# EAGLE design func_gen (EAGLE 6.3)
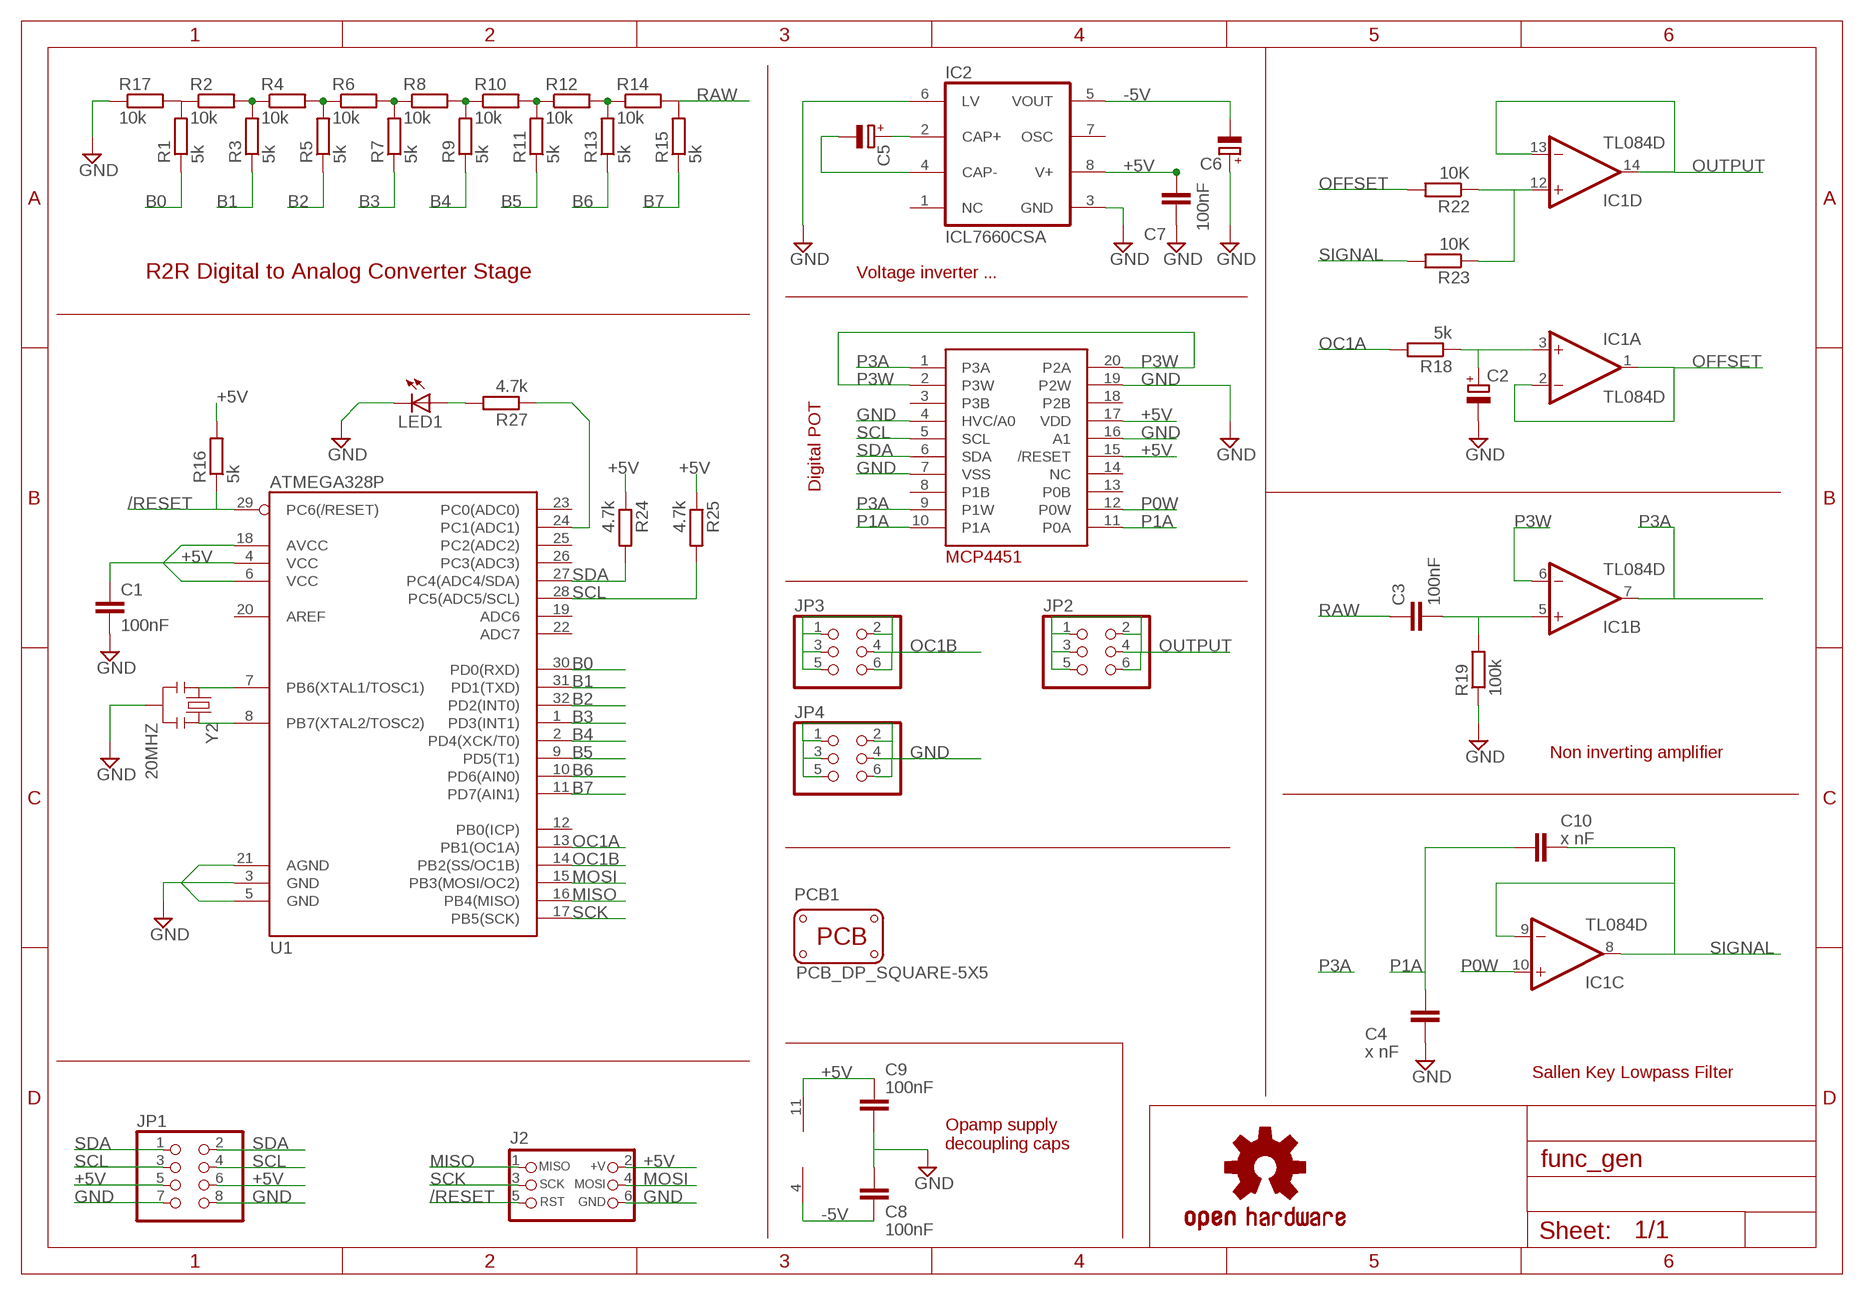
[diagram p0: schematic, sheet 1]

## Parts
C1  100nF  C-EUC0603  [C0603]
C2  CPOL-EUE5-5  [E5-5]
C3  100nF  C-EUC0603  [C0603]
C4  x nF  C-EUC0603  [C0603]
C5  CPOL-EUE5-5  [E5-5]
C6  CPOL-EUE5-5  [E5-5]
C7  100nF  C-EUC0603  [C0603]
C8  100nF  C-EUC0603  [C0603]
C9  100nF  C-EUC0603  [C0603]
C10  x nF  C-EUC0603  [C0603]
IC1  TL084D  [SO14]
IC2  ICL7660CSA  [SO08]
J2  CON_HEADER_PRG_AVR_ICSP  [HEADER_PRG_2X03]
JP1  PINHD-2X4  [2X04]
JP2  PINHD-2X3  [2X03]
JP3  PINHD-2X3  [2X03]
JP4  PINHD-2X3  [2X03]
LED1  LED-0805  [LED-805]
LOGO1  OSHW-LOGOM  [OSHW-LOGO-M]
PCB1  PCB_DP_SQUARE-5X5  [DP5050_V1]
R1  5k  R-EU_R0603  [R0603]
R2  10k  R-EU_R0603  [R0603]
R3  5k  R-EU_R0603  [R0603]
R4  10k  R-EU_R0603  [R0603]
R5  5k  R-EU_R0603  [R0603]
R6  10k  R-EU_R0603  [R0603]
R7  5k  R-EU_R0603  [R0603]
R8  10k  R-EU_R0603  [R0603]
R9  5k  R-EU_R0603  [R0603]
R10  10k  R-EU_R0603  [R0603]
R11  5k  R-EU_R0603  [R0603]
R12  10k  R-EU_R0603  [R0603]
R13  5k  R-EU_R0603  [R0603]
R14  10k  R-EU_R0603  [R0603]
R15  5k  R-EU_R0603  [R0603]
R16  5k  R-EU_R0603  [R0603]
R17  10k  R-EU_R0603  [R0603]
R18  5k  R-EU_R0603  [R0603]
R19  100k  R-EU_R0603  [R0603]
R22  10K  R-EU_R0603  [R0603]
R23  10K  R-EU_R0603  [R0603]
R24  4.7k  R-EU_R0603  [R0603]
R25  4.7k  R-EU_R0603  [R0603]
R27  4.7k  R-EU_R0603  [R0603]
U1  ATMEGA328P  ATMEGA328_SMT  [TQFP32-08]
U$1  IHSAN_MCP4451DOGRU  [TSSOP20]
Y2  20MHZ  RESONATORPTH  [RESONATOR-PTH]

## Nets
+5V: C1.1 C7.2 C9.2 IC1.11(P:V-) IC2.8(V+) J2.2(+V) JP1.5 JP1.6 R16.2 R24.1 R25.1 U1.4(VCC) U1.6(VCC) U1.18(AVCC) U$1.15(/RESET) U$1.17(VDD)
-5V: C6.- C8.1 IC1.4(P:V+) IC2.5(VOUT)
/RESET: J2.5(RST) R16.1 U1.29(PC6(/RESET))
B0: R1.1 U1.30(PD0(RXD))
B1: R3.1 U1.31(PD1(TXD))
B2: R5.1 U1.32(PD2(INT0))
B3: R7.1 U1.1(PD3(INT1))
B4: R9.1 U1.2(PD4(XCK/T0))
B5: R11.1 U1.9(PD5(T1))
B6: R13.1 U1.10(PD6(AIN0))
B7: R15.1 U1.11(PD7(AIN1))
GND: C1.2 C2.- C4.1 C6.+ C7.1 C8.2 C9.1 IC2.3(GND) IC2.6(LV) J2.6(GND) JP1.7 JP1.8 JP4.1 JP4.2 JP4.3 JP4.4 JP4.5 JP4.6 LED1.C R17.1 R19.1 U1.3(GND) U1.5(GND) U1.21(AGND) U$1.4(HVC/A0) U$1.7(VSS) U$1.16(A1) U$1.19(P2W) Y2.2
MISO: J2.1(MISO) U1.16(PB4(MISO))
MOSI: J2.4(MOSI) U1.15(PB3(MOSI/OC2))
N$1: R1.2 R2.1 R17.2
N$2: R2.2 R3.2 R4.1
N$3: R4.2 R5.2 R6.1
N$4: R6.2 R7.2 R8.1
N$5: R8.2 R9.2 R10.1
N$6: R10.2 R11.2 R12.1
N$7: R12.2 R13.2 R14.1
N$8: U1.8(PB7(XTAL2/TOSC2)) Y2.3
N$9: U1.7(PB6(XTAL1/TOSC1)) Y2.1
N$10: C2.+ IC1.3(A:+IN) R18.1
N$11: C3.2 IC1.5(B:+IN) R19.2
N$12: C5.+ IC2.2(CAP+)
N$13: C5.- IC2.4(CAP-)
N$16: IC1.12(D:+IN) R22.1 R23.1
N$17: R27.1 U1.24(PC1(ADC1))
N$18: LED1.A R27.2
OC1A: R18.2 U1.13(PB1(OC1A))
OC1B: JP3.1 JP3.2 JP3.3 JP3.4 JP3.5 JP3.6 U1.14(PB2(SS/OC1B))
OFFSET: IC1.1(A:OUT) IC1.2(A:-IN) R22.2
OUTPUT: IC1.13(D:-IN) IC1.14(D:OUT) JP2.1 JP2.2 JP2.3 JP2.4 JP2.5 JP2.6
P0W: IC1.10(C:+IN) U$1.12(P0W)
P1A: C4.2 C10.1 U$1.10(P1A) U$1.11(P0A)
P3A: IC1.7(B:OUT) U$1.1(P3A) U$1.9(P1W)
P3W: IC1.6(B:-IN) U$1.2(P3W) U$1.20(P2A)
RAW: C3.1 R14.2 R15.2
SCK: J2.3(SCK) U1.17(PB5(SCK))
SCL: JP1.3 JP1.4 R25.2 U1.28(PC5(ADC5/SCL)) U$1.5(SCL)
SDA: JP1.1 JP1.2 R24.2 U1.27(PC4(ADC4/SDA)) U$1.6(SDA)
SIGNAL: C10.2 IC1.8(C:OUT) IC1.9(C:-IN) R23.2
Unconnected: IC2.1(NC) IC2.7(OSC) U1.12(PB0(ICP)) U1.19(ADC6) U1.20(AREF) U1.22(ADC7) U1.23(PC0(ADC0)) U1.25(PC2(ADC2)) U1.26(PC3(ADC3)) U$1.3(P3B) U$1.8(P1B) U$1.13(P0B) U$1.14(NC) U$1.18(P2B)

## Notes on the sheet
- R2R Digital to Analog Converter Stage | Voltage inverter ...
- Digital POT
- Non inverting amplifier
- Sallen Key Lowpass Filter
- Opamp supply
  decoupling caps

## Library data of the parts
C1 C3 C4 C7-C10 = rcl:C-EU: CAPACITOR, European symbol
C2 C5 C6 = rcl:CPOL-EU: POLARIZED CAPACITOR, European symbol
IC1 = linear:TL084: OP AMP
IC2 = maxim:ICL7660CSA: VOLTAGE CONVERTER; MF: MAXIM; MPN: ICL7660CSA; OC_FARNELL: 9724710; OC_NEWARK: 34C3732
J2 = dp_devices:CON_HEADER_PRG_AVR_ICSP: 2x3 AVR ICSP programming header
JP1 = pinhead:PINHD-2X4: PIN HEADER
JP2-JP4 = pinhead:PINHD-2X3: PIN HEADER
LED1 = dp_devices:LED: Light Emitting Diode
LOGO1 = SparkFun-Aesthetics:OSHW-LOGO: Open Source Hardware Logo This logo indicates the piece of hardware it is found on incorporates a OSHW license and/or adheres to the definition of open source hardware found here: http://freedomdefined.org/OSHW
PCB1 = dp_devices:PCB_DP_SQUARE: Dangerous Prototypes Standard Square PCB sizes
R1-R19 R22-R25 R27 = rcl:R-EU_: RESISTOR, European symbol
U1 = SparkFun-DigitalIC:ATMEGA328_SMT: 32-Pin Atmega328 part Commonly used on Arduino compatible boards Available in QFP and QFN packages TQFP is IC-09069 QFN is non-stock; PROD_ID: IC-09069
U$1 = SparkFun-DigitalIC:IHSAN_MCP4451
Y2 = SparkFun-FreqCtrl:RESONATOR: Resonator Small SMD resonator. Used, eg, on the Arduino Pro/ Pro Mini boards. 8MHz- XTAL-08895 16MHz- XTAL-08900

## Board
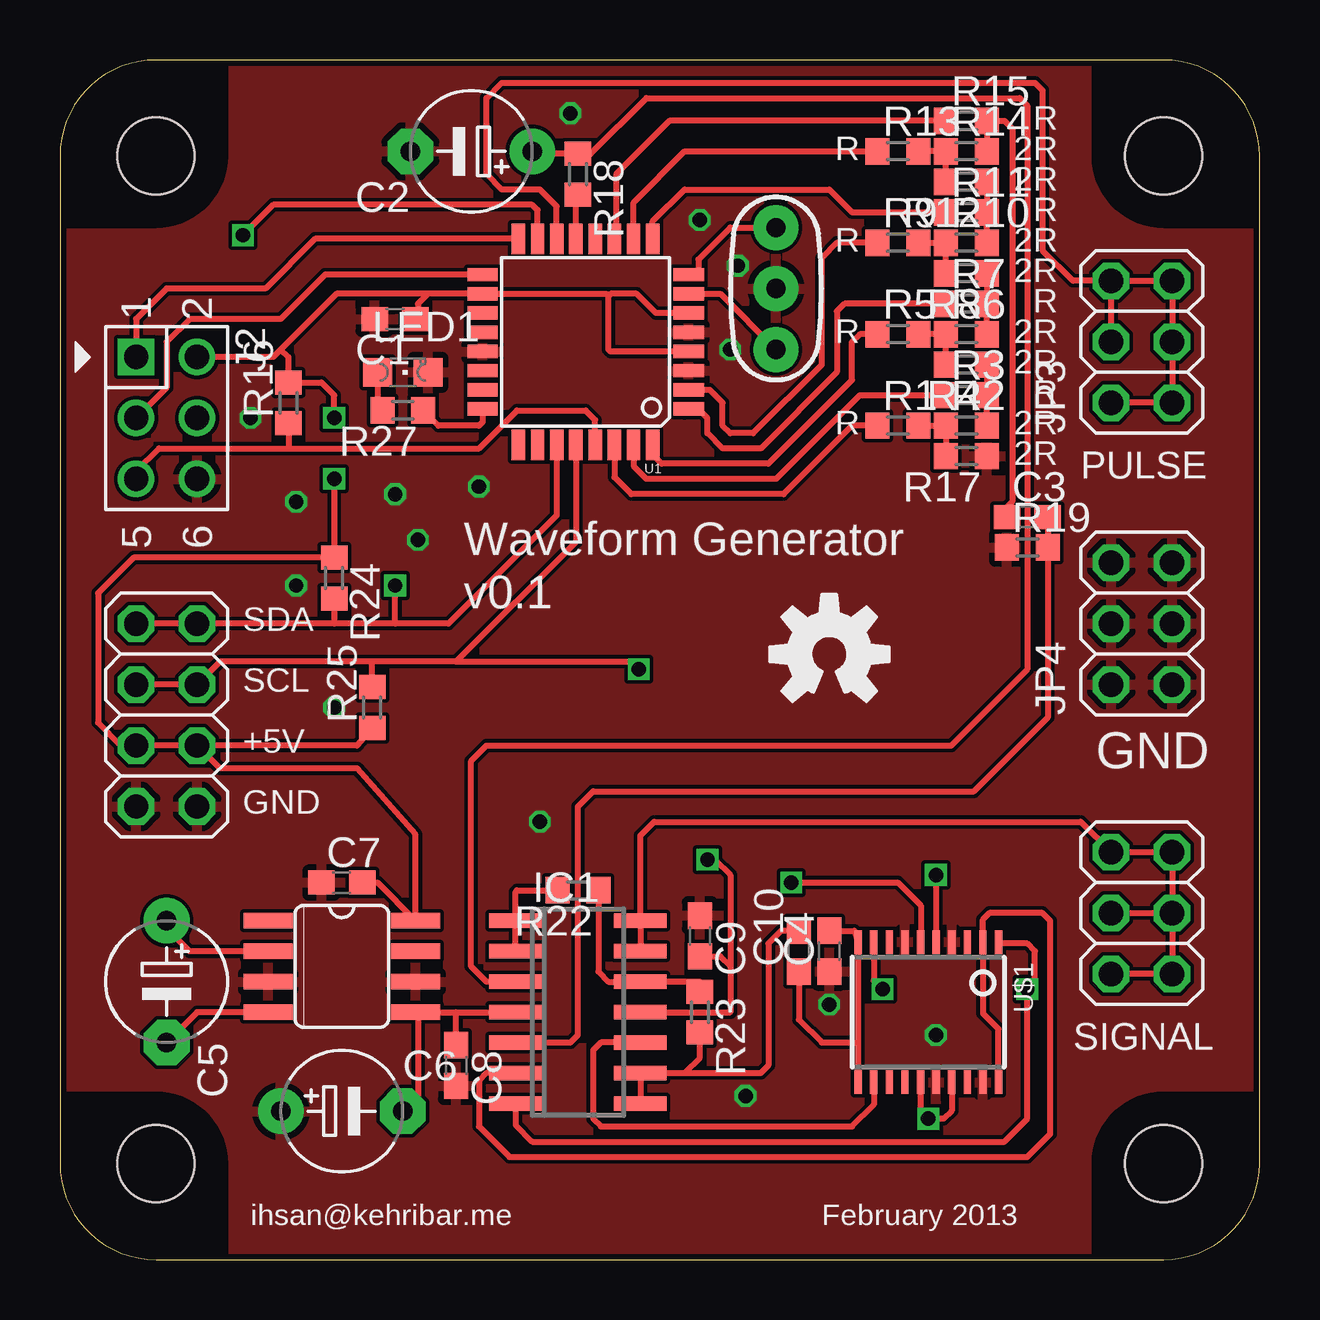
[diagram p1: board, top side]
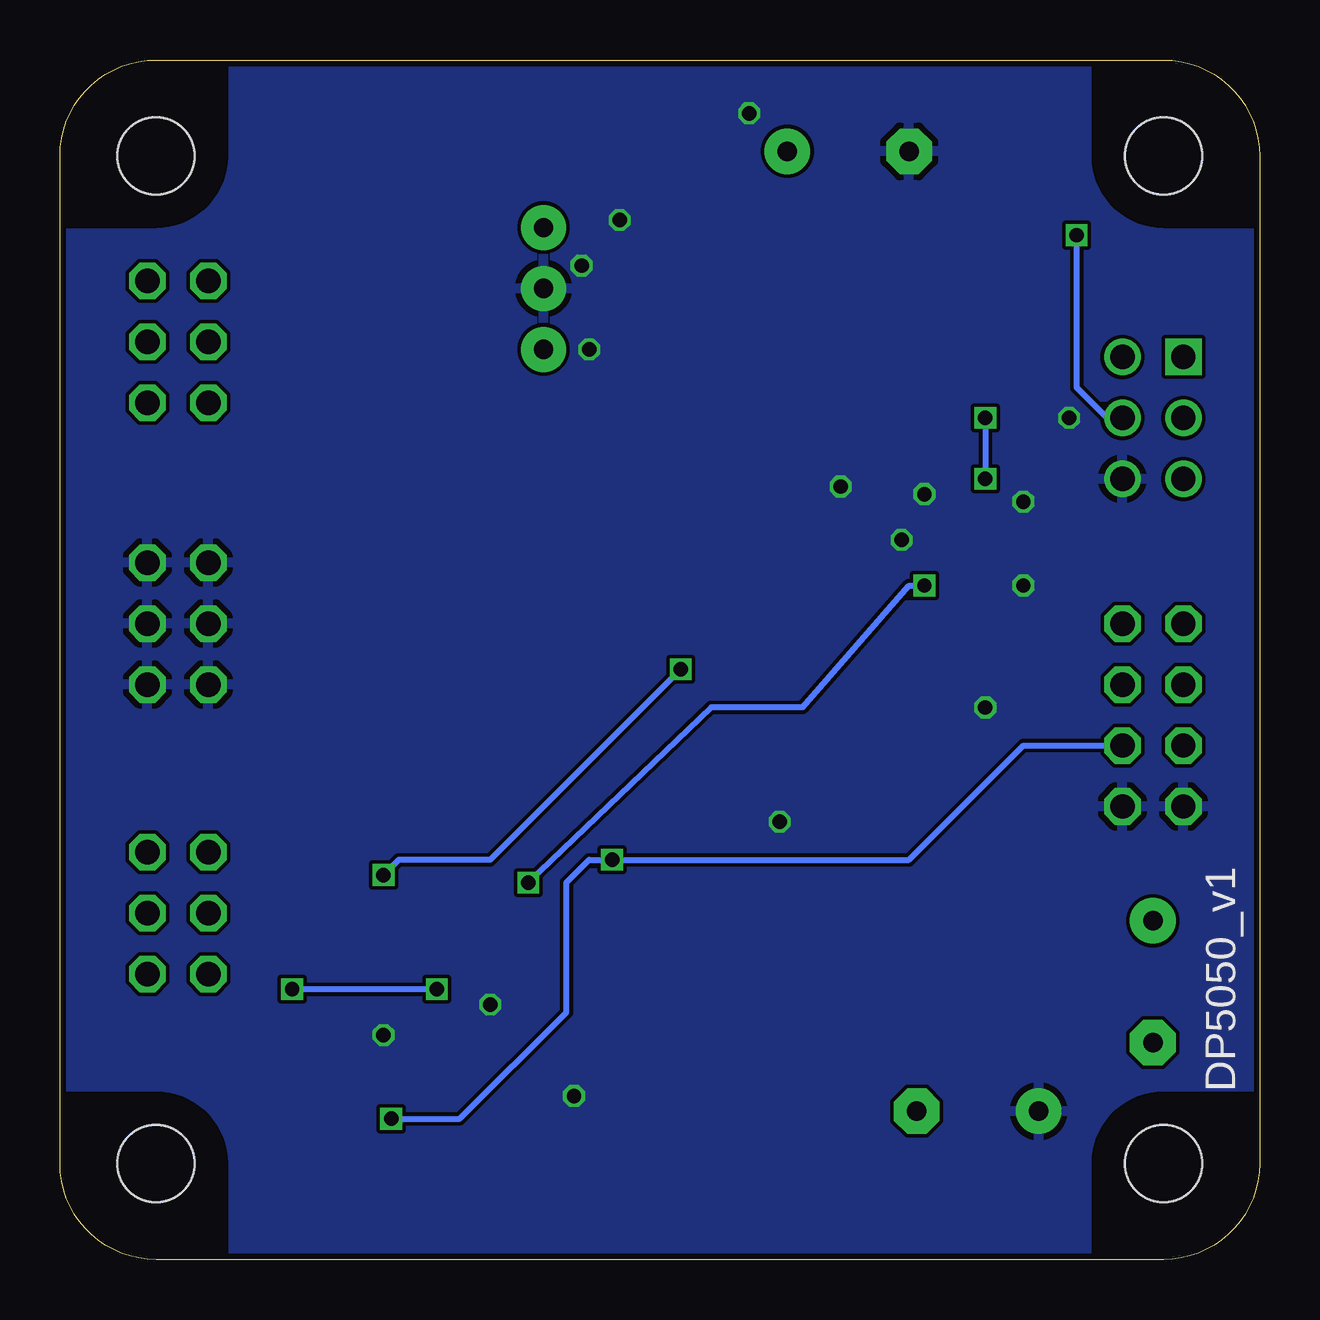
[diagram p2: board, bottom side, seen from below]

Size 50 x 50 mm. Coordinates in mm from the lower left corner, seen from the top.
Copper layers (1*16): Top 0.035mm / dielectric 1.5mm / Bottom 0.035mm
Design rules "Fusion_eagle_rule_v1.1": minimum track width 6mil, minimum drill 12mil, track to track 6mil, track to pad 6mil, pad to pad 6mil, via to via 6mil, smd to smd 0mil, copper to edge 10mil, drill to drill 10mil, minimum pad ring 10mil, minimum via ring 6mil, stop-mask expansion 2mil, vias tented up to drill 100mil, thermal gap 10mil

### Footprints (pad centres in the part's own frame; a part is rotated, then mirrored left to right if it is on the bottom)
C0603 = smd 1.1 x 1: 1 -0.85,0; 2 0.85,0
E5-5 = drill 0.813 pad 1.905: + -2.54,0 | drill 0.813 pad 1.905 octagon: - 2.54,0
SO14 = smd 0.6 x 2.2: 1 -3.81,-2.6; 2 -2.54,-2.6; 3 -1.27,-2.6; 4 0,-2.6; 5 1.27,-2.6; 6 2.54,-2.6; 7 3.81,-2.6; 8 3.81,2.6; 9 2.54,2.6; 10 1.27,2.6; 11 0,2.6; 12 -1.27,2.6; 13 -2.54,2.6; 14 -3.81,2.6
SO08 = smd 0.66 x 2.032: 1 -1.905,-3.073; 2 -0.635,-3.073; 3 0.635,-3.073; 4 1.905,-3.073; 5 1.905,3.073; 6 0.635,3.073; 7 -0.635,3.073; 8 -1.905,3.073
HEADER_PRG_2X03 = drill 1.016 square: 1 -2.54,-1.27 | drill 1.016: 2 -2.54,1.27; 3 0,-1.27; 4 0,1.27; 5 2.54,-1.27; 6 2.54,1.27
2X04 = drill 1.016 octagon: 1 -3.81,-1.27; 2 -3.81,1.27; 3 -1.27,-1.27; 4 -1.27,1.27; 5 1.27,-1.27; 6 1.27,1.27; 7 3.81,-1.27; 8 3.81,1.27
2X03 = drill 1.016 octagon: 1 -2.54,-1.27; 2 -2.54,1.27; 3 0,-1.27; 4 0,1.27; 5 2.54,-1.27; 6 2.54,1.27
LED-805 = smd 1.2 x 1.2: A 0,-1.05; C 0,1.05
DP5050_V1 = hole 3.2: 4,4; 46,4; 46,46; 4,46
R0603 = smd 1 x 1.1: 1 -0.85,0; 2 0.85,0
TQFP32-08 = smd 1.27 x 0.559: 1 -4.293,2.8; 2 -4.293,2; 3 -4.293,1.2; 4 -4.293,0.4; 5 -4.293,-0.4; 6 -4.293,-1.2; 7 -4.293,-2; 8 -4.293,-2.8; 17 4.293,-2.8; 18 4.293,-2; 19 4.293,-1.2; 20 4.293,-0.4; 21 4.293,0.4; 22 4.293,1.2; 23 4.293,2; 24 4.293,2.8 | smd 0.559 x 1.27: 9 -2.8,-4.293; 10 -2,-4.293; 11 -1.2,-4.293; 12 -0.4,-4.293; 13 0.4,-4.293; 14 1.2,-4.293; 15 2,-4.293; 16 2.8,-4.293; 25 2.8,4.293; 26 2,4.293; 27 1.2,4.293; 28 0.4,4.293; 29 -0.4,4.293; 30 -1.2,4.293; 31 -2,4.293; 32 -2.8,4.293
TSSOP20 = smd 0.305 x 0.991: 1 -2.925,-2.918; 2 -2.275,-2.918; 3 -1.625,-2.918; 4 -0.975,-2.918; 5 -0.325,-2.918; 6 0.325,-2.918; 7 0.975,-2.918; 8 1.625,-2.918; 9 2.275,-2.918; 10 2.925,-2.918; 11 2.925,2.918; 12 2.275,2.918; 13 1.625,2.918; 14 0.975,2.918; 15 0.325,2.918; 16 -0.325,2.918; 17 -0.975,2.918; 18 -1.625,2.918; 19 -2.275,2.918; 20 -2.925,2.918
RESONATOR-PTH = drill 0.8 pad 1.88: 1 -2.54,0; 2 0,0; 3 2.54,0

### Placement (x,y rotation side)
C1  13.97,39.2 180 top
C2  17.14,46.19 180 top
C3  40.32,30.95 0 top
C4  32.07,12.85 90 top
C5  4.45,11.58 270 top
C6  11.75,6.19 0 top
C7  11.75,15.71 0 top
C8  16.51,8.09 270 top
C9  26.67,13.49 270 top
C10  30.8,12.85 90 top
IC1  21.59,10.31 270 top
IC2  11.75,12.22 270 top
J2  4.45,35.08 270 top
JP1  4.45,22.7 270 top
JP2  45.09,14.44 90 top
JP3  45.09,38.25 90 top
JP4  45.09,26.51 90 top
LED1  14.29,36.98 270 top
LOGO1  32.07,25.23 0 top
PCB1  0,50 270 top
R1  34.92,34.76 0 top
R2  37.78,34.76 0 top
R3  37.78,36.03 0 top
R4  37.78,37.3 180 top
R5  34.92,38.57 0 top
R6  37.78,38.57 0 top
R7  37.78,39.84 0 top
R8  37.78,41.11 180 top
R9  34.92,42.38 0 top
R10  37.78,42.38 0 top
R11  37.78,43.65 0 top
R12  37.78,44.92 180 top
R13  34.92,46.19 0 top
R14  37.78,46.19 0 top
R15  37.78,47.46 0 top
R16  9.53,35.71 90 top
R17  37.78,33.49 180 top
R18  21.59,45.24 270 top
R19  40.32,29.68 0 top
R22  21.59,15.39 180 top
R23  26.67,10.31 270 top
R24  11.43,28.41 270 top
R25  13.02,23.01 90 top
R27  14.29,35.4 180 top
U1  21.91,38.25 180 top
U$1  36.2,10.31 180 top
Y2  29.84,40.48 90 top

### Tracks (layer width: path | path; a pad name or v marks a point on that pad's centre or on a via)
+5V  (via drill 0.6)
  Top 0.254: 23.58,37.85 U1.4 22.94,37.85 22.86,37.94 22.86,40.16 | U1.6 24.84,39.45 24.04,40.25 22.95,40.25 22.86,40.16 | 22.86,40.16 22.77,40.25 U1.18 15.34,40.25 | 15.34,40.25 11.53,40.25 9.21,37.94 | J2.2 8.89,37.62 9.21,37.94 | JP1.6 JP1.5 2.54,21.43 1.59,22.38 1.59,27.78 3.07,29.26 R24.1 v11.43,32.54 | R25.1 12.38,21.43 JP1.6 | JP1.6 6.67,20.47 12.38,20.47 14.82,17.72 IC2.8 13.23,15.71 C7.2 | 15.34,40.25 14.92,39.84 14.92,39.31 C1.1 | 9.21,37.94 9.53,37.62 R16.2 10.9,36.56 11.43,36.03 v11.43,35.08 | IC1.11 27.94,10.31 27.94,12.22 | U$1.17 37.17,6.21 36.83,5.87 v36.2,5.87 35.87,5.88 U$1.15 | C9.2 27.52,12.64 27.94,12.22 | v26.99,16.66 27.3,16.66 27.94,16.03 27.94,12.22
  Bottom 0.254: v11.43,35.08 v11.43,32.54 | JP1.6 9.84,21.43 14.61,16.66 v26.99,16.66 27.94,16.66 28.89,15.71 28.89,10.31 33.34,5.87 v36.2,5.87
-5V
  Top 0.254: 14.92,10.31 IC2.5 14.92,10.21 | 14.92,10.31 16.51,10.31 | 14.92,10.21 14.92,10.31 | 14.92,10.21 14.92,6.82 C6.- | C8.1 16.51,10.31 | 16.51,10.31 IC1.4
/RESET
  Top 0.254: J2.5 3.17,32.86 4.13,33.81 9.53,33.81 | 9.53,33.81 17.46,33.81 19.05,35.4 21.91,35.4 22.31,34.99 U1.29 | R16.1 9.53,33.81
B0
  Top 0.254: R1.1 33.02,34.76 30.16,31.9 23.81,31.9 23.11,32.61 U1.30
B1
  Top 0.254: R3.1 33.34,36.03 29.84,32.54 24.45,32.54 23.91,33.08 U1.31
B2
  Top 0.254: R5.1 33.34,38.57 33.02,38.25 33.02,36.66 29.53,33.17 25.08,33.17 24.77,33.49 24.77,33.9 U1.32
B3
  Top 0.254: R7.1 32.7,39.84 32.38,39.52 32.38,36.98 29.21,33.81 27.62,33.81 26.99,34.44 26.99,35.08 26.67,35.4 26.26,35.4 U1.1 26.04,35.29
B4
  Top 0.254: R9.1 32.38,42.38 31.75,41.74 31.75,37.3 28.89,34.44 27.94,34.44 27.62,34.76 27.62,35.71 27.08,36.25 U1.2
B5
  Top 0.254: R11.1 33.02,43.65 32.07,44.6 26.04,44.6 24.71,43.27 U1.9
B6
  Top 0.254: U1.10 23.91,44.06 26.04,46.19 R13.1
B7
  Top 0.254: R15.1 25.4,47.46 23.18,45.24 23.18,42.62 U1.11
GND  (via drill 0.6)
  other vias: 27.94,37.94 28.26,41.43 17.46,32.22 14.92,30 13.97,31.9 9.84,28.09 9.84,31.59 26.67,43.33 7.94,35.08 11.43,23.01 21.27,47.78 32.07,10.63 36.51,9.36 20,18.25 28.57,6.82
  pour Bottom: 52.07,52.22 52.07,-2.07 -2.86,-2.07 -2.86,52.22
  pour Top: 51.12,50.95 51.12,-1.43 -1.91,-1.12 -1.91,51.27
MISO
  Top 0.254: U1.16 10.64,42.55 8.57,40.48 4.45,40.48 3.17,39.2 J2.1
MOSI  (via drill 0.6)
  Top 0.254: U1.15 19.91,43.74 19.68,43.97 8.89,43.97 v7.62,42.7
  Bottom 0.254: J2.4 6.35,35.08 7.62,36.35 v7.62,42.7
N$1
  Top 0.254: R1.2 R2.1 R17.2
N$2
  Top 0.254: R4.1 R3.2 R2.2
N$3
  Top 0.254: R5.2 R6.1 R4.2
N$4
  Top 0.254: R8.1 R7.2 R6.2
N$5
  Top 0.254: R9.2 R10.1 R8.2
N$6
  Top 0.254: R12.1 R11.2 R10.2
N$7
  Top 0.254: R13.2 R14.1 R12.2
N$8
  Top 0.254: U1.8 26.61,41.05 26.61,41.69 27.94,43.02 Y2.3
N$9
  Top 0.254: U1.7 27.53,40.25 Y2.1
N$10
  Top 0.254: C2.+ 19.79,46.09 R18.1 22.12,46.09 24.45,48.41 40.01,48.41 40.32,48.09 40.32,24.6 37.15,21.43 17.78,21.43 17.14,20.79 17.14,12.22 17.78,11.58 IC1.3
N$11
  Top 0.254: C3.2 R19.2 41.17,22.59 38.1,19.52 22.23,19.52 21.59,18.89 21.59,9.36 21.27,9.04 IC1.5
N$12
  Top 0.254: IC2.2 5.4,12.85 4.45,13.81 C5.+
N$13
  Top 0.254: IC2.4 5.71,10.31 C5.-
N$16
  Top 0.254: R23.1 26.67,11.58 IC1.12 22.86,11.58 22.44,12 R22.1
N$17
  Top 0.254: U1.24 17.61,34.91 17.46,34.76 15.77,34.76 R27.1
N$18
  Top 0.254: LED1.A 13.24,35.59 R27.2
OC1A
  Top 0.254: U1.13 21.51,44.3 R18.2
OC1B
  Top 0.254: U1.14 20.71,43.9 20,44.6 18.41,44.6 17.78,45.24 17.78,48.41 18.41,49.05 40.64,49.05 40.96,48.73 40.96,42.06 42.23,40.79 JP3.6 | JP3.4 JP3.6 | JP3.6 JP3.5 JP3.3 JP3.1 JP3.2
OFFSET
  Top 0.254: IC1.1 IC1.2 18.99,15.33 19.05,15.39 R22.2
OUTPUT
  Top 0.254: IC1.13 IC1.14 24.19,17.68 24.77,18.25 42.55,18.25 JP2.6 JP2.5 JP2.3 | JP2.4 JP2.3 | JP2.3 JP2.1 JP2.2
P0W
  Top 0.254: U$1.12 33.92,6.45 33.02,5.55 22.54,5.55 22.23,5.87 22.23,8.73 22.54,9.04 IC1.10
P1A
  Top 0.254: 33.27,9.04 U$1.10 33.11,13.7 C4.2 | 33.27,9.04 U$1.11 | C10.1 30.8,10 31.75,9.04 33.27,9.04
P3A  (via drill 0.6)
  Top 0.254: U$1.9 33.92,11.64 v34.29,11.27 | U$1.1 39.18,13.17 40.32,13.17 40.64,12.85 40.64,11.58 v40.32,11.27 40.32,5.87 39.37,4.92 19.68,4.92 18.99,5.61 IC1.7
  Bottom 0.254: v34.29,11.27 v40.32,11.27
P3W
  Top 0.254: U$1.20 39.12,9.61 38.47,10.26 U$1.2 38.47,14.18 38.73,14.44 40.96,14.44 41.27,14.12 41.27,5.23 40.32,4.28 18.73,4.28 17.46,5.55 17.46,7.46 17.78,7.77 IC1.6
RAW
  Top 0.254: R14.2 R15.2 39.37,47.46 39.69,47.14 39.69,31.59 39.05,30.95 C3.1
SCK
  Top 0.254: U1.17 11.05,41.05 9.21,39.2 5.4,39.2 4.45,38.25 4.45,36.35 J2.3
SCL  (via drill 0.6)
  Top 0.254: JP1.3 JP1.4 6.67,24.92 13.02,24.92 | U1.28 21.51,29.91 16.51,24.92 | 16.51,24.92 13.02,24.92 | R25.2 13.02,24.92 | 16.51,24.92 23.81,24.92 v24.13,24.6 | v36.51,16.03 U$1.5
  Bottom 0.254: v24.13,24.6 32.07,16.66 35.88,16.66 v36.51,16.03
SDA  (via drill 0.6)
  Top 0.254: U1.27 20.71,31.02 16.19,26.51 13.97,26.51 | 13.97,26.51 11.43,26.51 | 11.43,26.51 JP1.2 JP1.1 | R24.2 11.43,26.51 | 13.97,26.51 v13.97,28.09 | v30.48,15.71 34.92,15.71 35.88,14.76 U$1.6
  Bottom 0.254: v13.97,28.09 14.61,28.09 19.05,23.01 22.86,23.01 v30.48,15.71
SIGNAL
  Top 0.254: IC1.8 IC1.9 26.04,7.77 | R23.2 26.67,8.41 26.04,7.77 | C10.2 30.06,13.7 29.53,13.17 29.53,8.09 29.21,7.77 26.04,7.77

### Text on the board
tPlace: R | R | 2R | 2R | R | R | 2R | 2R | R | R | 2R | 2R | R | R | 2R | 2R | PULSE | Waveform Generator | v0.1 | SDA | SCL | +5V | GND | GND | SIGNAL | ihsan@kehribar.me | February 2013